# EAGLE design SCK_URBAN_BOARD_2.2 (EAGLE 9.6.2)
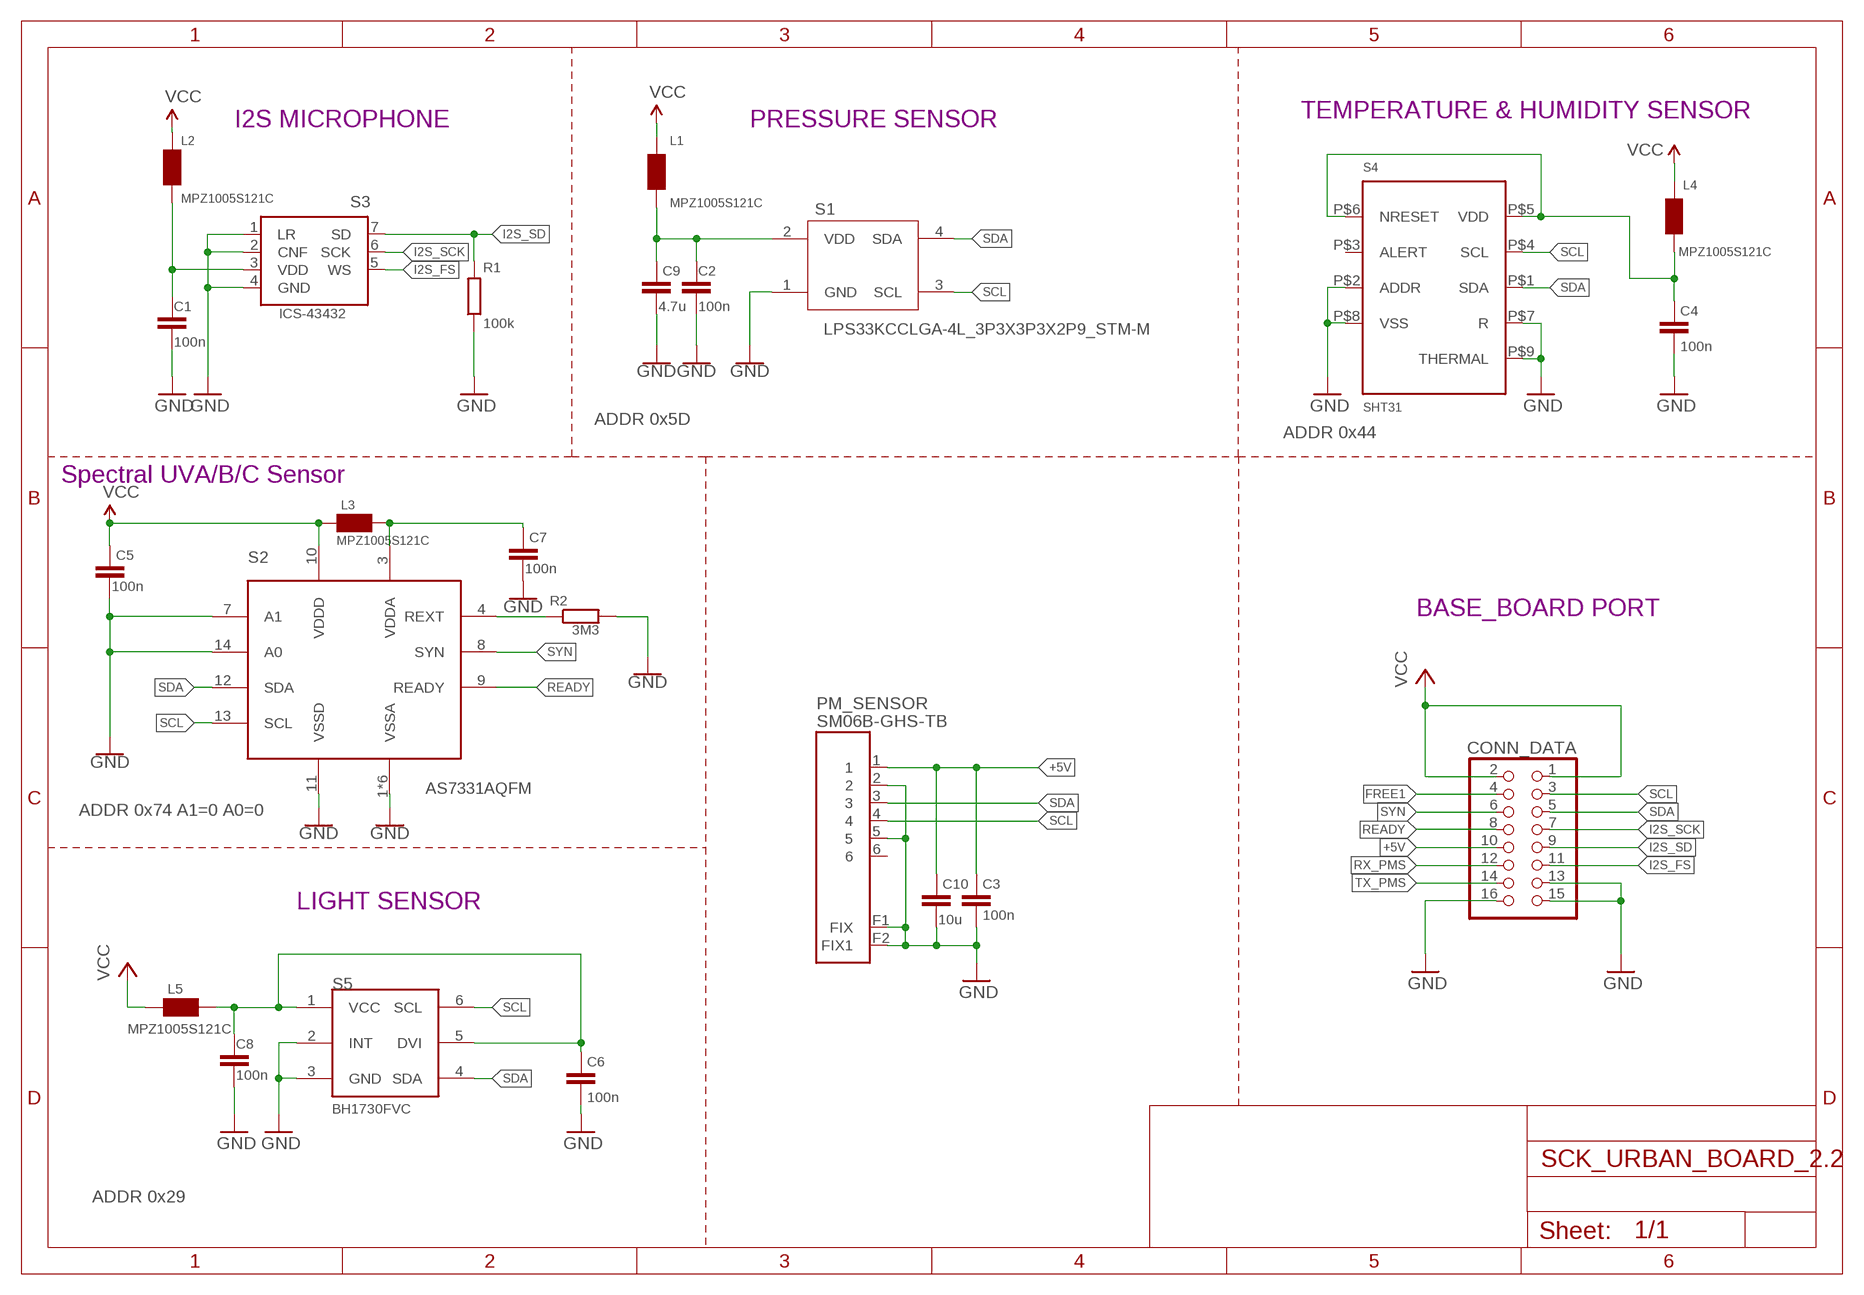
[diagram p0: schematic, sheet 1]

## Parts
C1  100n  C-EUC0402  [C0402]
C2  100n  C-EUC0402  [C0402]
C3  100n  C-EUC0402  [C0402]
C4  100n  C-EUC0402  [C0402]
C5  100n  C-EUC0402  [C0402]
C6  100n  C-EUC0402  [C0402]
C7  100n  C-EUC0402  [C0402]
C8  100n  C-EUC0402  [C0402]
C9  4.7u  C-EUC0603  [C0603]
C10  10u  C-EUC0603  [C0603]
CONN_DATA  PINHD_2X8MAL_SMD  [PINHD_2X8_SMD_MALE_UNHOLED]
L1  MPZ1005S121C  FERRITE-BEAD_0402  [L0402]
L2  MPZ1005S121C  FERRITE-BEAD_0402  [L0402]
L3  MPZ1005S121C  FERRITE-BEAD_0402  [L0402]
L4  MPZ1005S121C  FERRITE-BEAD_0402  [L0402]
L5  MPZ1005S121C  FERRITE-BEAD_0402  [L0402]
PM_SENSOR  SM06B-GHS-TB  [SM06B-GHS-TB]
R1  100k  R-EU_R0402  [R0402]
R2  3M3  R-EU_R0402  [R0402]
S1  LPS33KCCLGA-4L_3P3X3P3X2P9_STM-M  [CCLGA-4L_3P3X3P3X2P9_STM-M]
S2  AS7331AQFM  [OLGA16]
S3  ICS-43432  [ICS-43432]
S4  SHT31  SHT3X-DIS  [DFN8_STH3X-DIS]
S5  BH1730FVC  [WSOF6]

## Nets
+5V: C3.2 C10.2 CONN_DATA.10 PM_SENSOR.1
FREE1: CONN_DATA.4
GND: C1.1 C2.1 C3.1 C4.1 C5.1 C6.1 C7.1 C8.1 C9.1 C10.1 CONN_DATA.13 CONN_DATA.15 CONN_DATA.16 PM_SENSOR.2 PM_SENSOR.5 PM_SENSOR.F1(FIX) PM_SENSOR.F2(FIX1) R1.1 R2.2 S1.1(GND) S2.1(VSSA) S2.2(VSSA) S2.5(VSSA) S2.6(VSSA) S2.7(A1) S2.11(VSSD) S2.14(A0) S2.15(VSSA) S2.16(VSSA) S3.1(LR) S3.2(CNF) S3.4(GND) S4.P$2(ADDR) S4.P$7(R) S4.P$8(VSS) S4.P$9(THERMAL) S5.2(INT) S5.3(GND)
I2S_FS: CONN_DATA.11 S3.5(WS)
I2S_SCK: CONN_DATA.7 S3.6(SCK)
I2S_SD: CONN_DATA.9 R1.2 S3.7(SD)
N$1: C7.2 L3.1 S2.3(VDDA)
N$2: R2.1 S2.4(REXT)
N$3: C6.2 C8.2 L5.2 S5.1(VCC) S5.5(DVI)
N$5: C4.2 L4.2 S4.P$5(VDD) S4.P$6(NRESET)
N$6: C2.2 C9.2 L1.2 S1.2(VDD)
N$17: C1.2 L2.2 S3.3(VDD)
READY: CONN_DATA.8 S2.9(READY)
RX_PMS: CONN_DATA.12
SCL: CONN_DATA.3 PM_SENSOR.4 S1.3(SCL) S2.13(SCL) S4.P$4(SCL) S5.6(SCL)
SDA: CONN_DATA.5 PM_SENSOR.3 S1.4(SDA) S2.12(SDA) S4.P$1(SDA) S5.4(SDA)
SYN: CONN_DATA.6 S2.8(SYN)
TX_PMS: CONN_DATA.14
VCC: C5.2 CONN_DATA.1 CONN_DATA.2 L1.1 L2.1 L3.2 L4.1 L5.1 S2.10(VDDD)
Unconnected: PM_SENSOR.6 S4.P$3(ALERT)

## Notes on the sheet
- TEMPERATURE & HUMIDITY SENSOR
- I2S MICROPHONE | PRESSURE SENSOR
- ADDR 0x5D
- ADDR 0x44
- Spectral UVA/B/C Sensor
- BASE_BOARD PORT
- ADDR 0x74 A1=0 A0=0
- LIGHT SENSOR
- ADDR 0x29

## Library data of the parts
C1-C10 = Hangar3D:C-EU: CAPACITOR, European symbol
CONN_DATA = Hangar3D:PINHD_2X8
L1-L5 = Hangar3D:FERRITE-BEAD: SMD EMI Suppression Ferrite Beads - excellent anti-EMI properties - low DCR - impedances till 3000 ohms - rated current up to 6 A
PM_SENSOR = Hangar3D:SM06B-GHS-TB
R1 R2 = Hangar3D:R-EU_: RESISTOR, European symbol
S1 = Hangar3D:LPS33K; COPYRIGHT: Copyright (C) 2023 Ultra Librarian. All rights reserved.; MANUFACTURER_PART_NUMBER: LPS33K; MFR_NAME: STMicroelectronics
S2 = Hangar3D:AS7331
S3 = Hangar3D:ICS-43432
S4 = Hangar3D:SHT3X-DIS
S5 = Hangar3D:BH1730FVC

## Net classes
1 power: width 1 mm, drill 0.6 mm, clearance 0.203 mm
2 gnd: width 0.254 mm, drill 0.254 mm, clearance 0.178 mm
3 usbvcc: width 0.254 mm, drill 0.6 mm, clearance 0.203 mm
4 aref: width 0.254 mm, drill 0.6 mm, clearance 0.203 mm

## Board
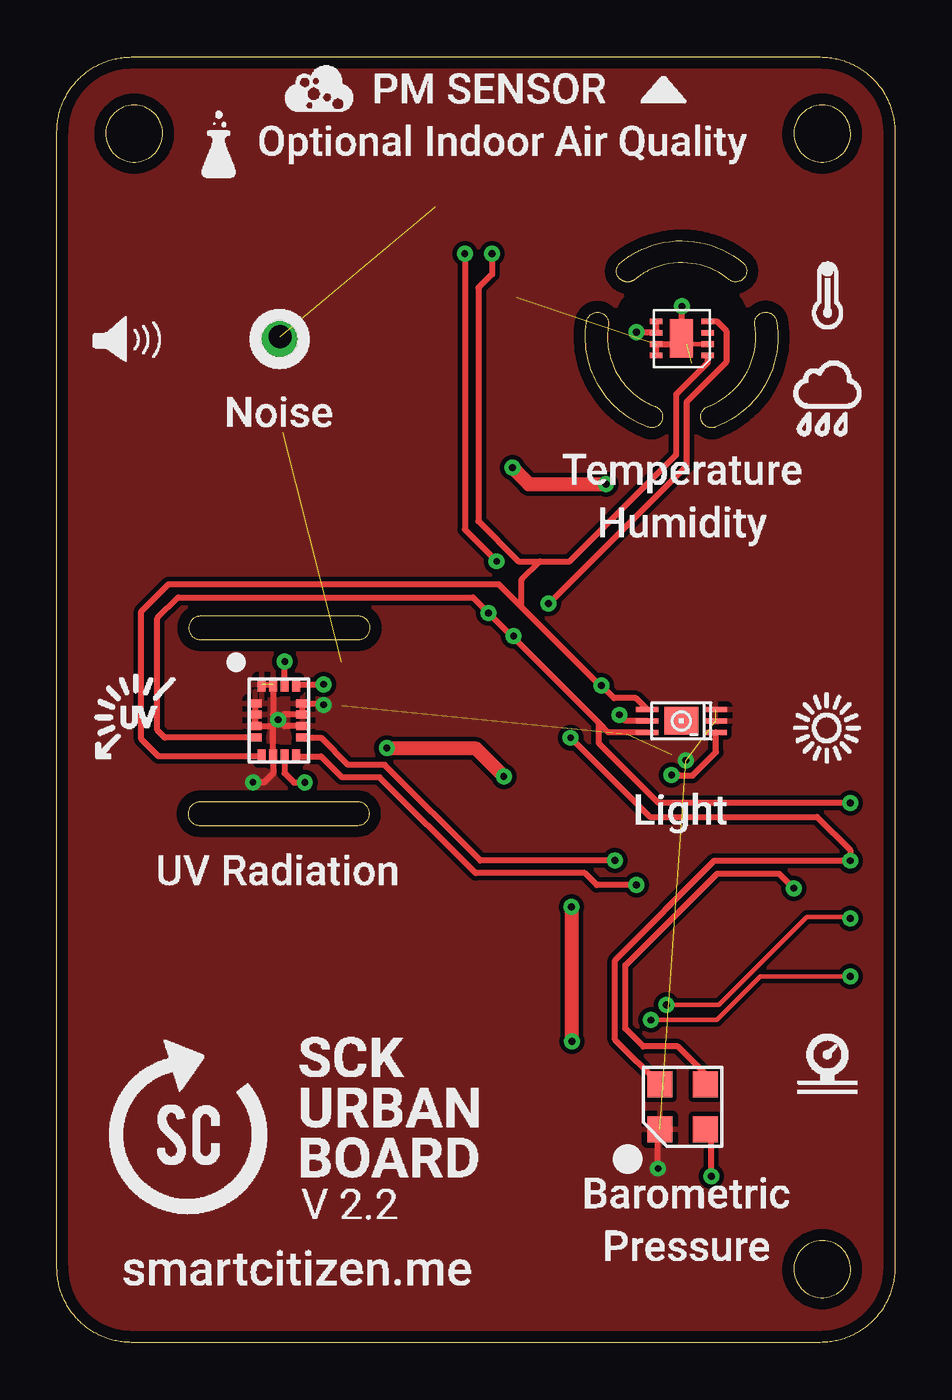
[diagram p1: board, top side]
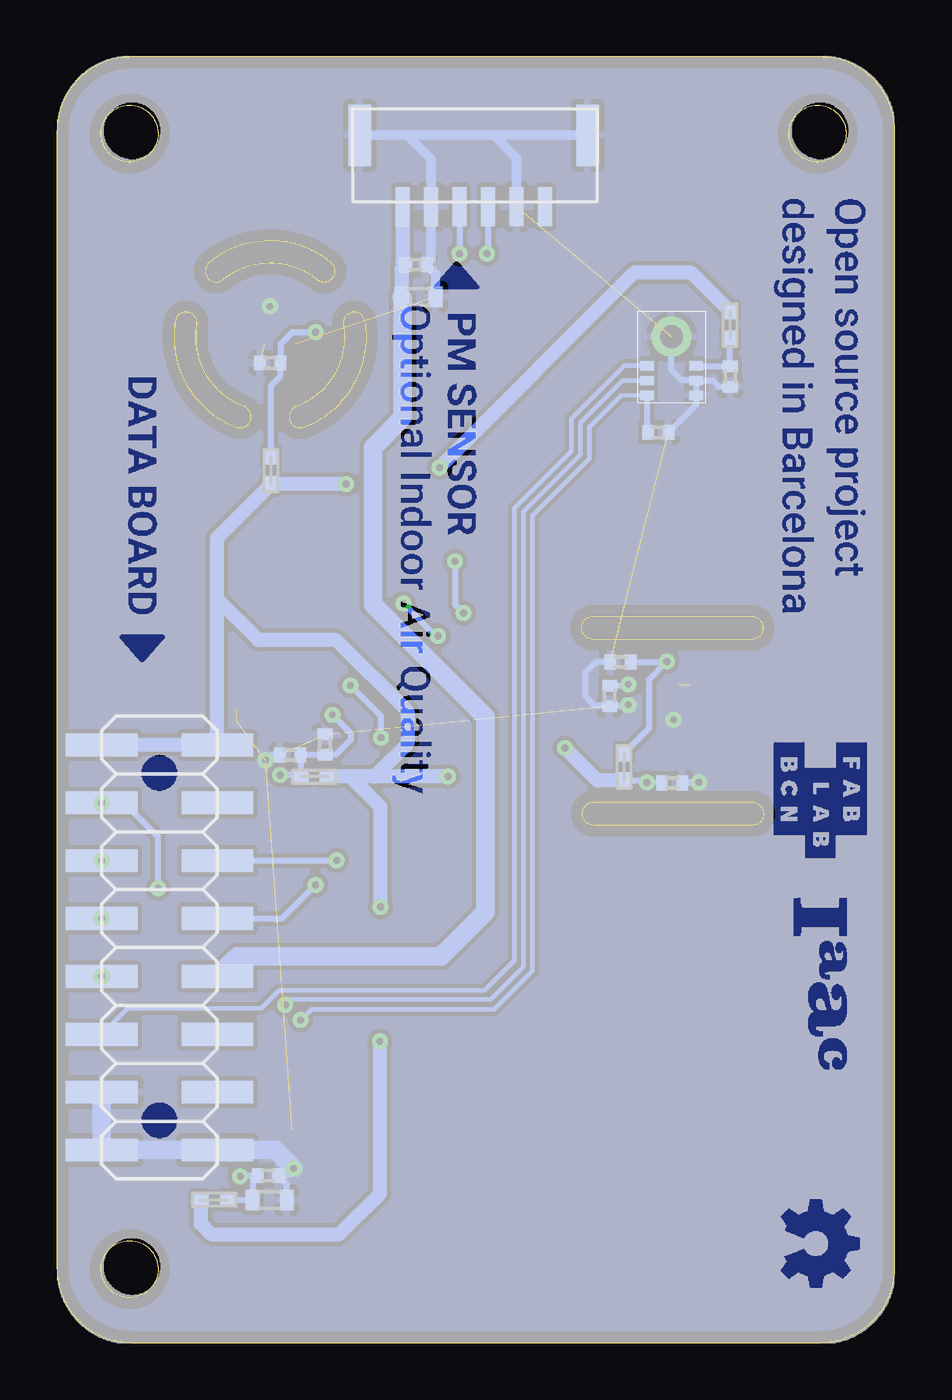
[diagram p2: board, bottom side, seen from below]

Size 36.78 x 56.42 mm. Coordinates in mm from the lower left corner, seen from the top.
Outline: 33.51,0 3.27,0 3.18,0 3.1,0 3.02,0.01 2.94,0.02 2.85,0.03 2.77,0.04 2.69,0.05 2.61,0.07 2.53,0.08 2.45,0.1 2.38,0.12 2.3,0.15 2.22,0.17 2.15,0.2 2.07,0.23 2,0.26 1.93,0.29 1.85,0.32 1.78,0.36 1.71,0.4 1.65,0.43 1.58,0.47 1.51,0.52 1.44,0.56 1.38,0.6 1.32,0.65 1.25,0.7 1.19,0.75 1.13,0.8 1.07,0.85 1.02,0.91 0.96,0.96 0.91,1.02 0.85,1.07 0.8,1.13 0.75,1.19 0.7,1.25 0.65,1.32 0.6,1.38 0.56,1.44 0.52,1.51 0.47,1.58 0.43,1.65 0.4,1.71 0.36,1.78 0.32,1.86 0.29,1.93 0.26,2 0.23,2.07 0.2,2.15 0.17,2.22 0.15,2.3 0.12,2.38 0.1,2.45 0.08,2.53 0.07,2.61 0.05,2.69 0.04,2.77 0.03,2.85 0.02,2.94 0.01,3.02 0,3.1 0,3.19 0,3.27 0,53.15 0,53.23 0,53.32 0.01,53.4 0.02,53.48 0.03,53.57 0.04,53.65 0.05,53.73 0.07,53.81 0.08,53.89 0.1,53.97 0.12,54.04 0.15,54.12 0.17,54.2 0.2,54.27 0.23,54.35 0.26,54.42 0.29,54.49 0.32,54.57 0.36,54.64 0.4,54.71 0.43,54.77 0.47,54.84 0.52,54.91 0.56,54.98 0.6,55.04 0.65,55.1 0.7,55.17 0.75,55.23 0.8,55.29 0.85,55.35 0.91,55.4 0.96,55.46 1.02,55.51 1.07,55.57 1.13,55.62 1.19,55.67 1.25,55.72 1.32,55.77 1.38,55.82 1.44,55.86 1.51,55.9 1.58,55.95 1.65,55.98 1.71,56.02 1.78,56.06 1.85,56.1 1.93,56.13 2,56.16 2.07,56.19 2.15,56.22 2.22,56.25 2.3,56.27 2.38,56.3 2.45,56.32 2.53,56.34 2.61,56.35 2.69,56.37 2.77,56.38 2.85,56.39 2.94,56.4 3.02,56.41 3.1,56.42 3.18,56.42 3.27,56.42 33.51,56.42 33.59,56.42 33.68,56.42 33.76,56.41 33.84,56.4 33.92,56.39 34.01,56.38 34.09,56.37 34.17,56.35 34.25,56.34 34.32,56.32 34.4,56.3 34.48,56.27 34.55,56.25 34.63,56.22 34.7,56.19 34.78,56.16 34.85,56.13 34.92,56.1 34.99,56.06 35.06,56.02 35.13,55.98 35.2,55.95 35.27,55.9 35.33,55.86 35.4,55.82 35.46,55.77 35.52,55.72 35.59,55.67 35.65,55.62 35.7,55.57 35.76,55.51 35.82,55.46 35.87,55.4 35.93,55.35 35.98,55.29 36.03,55.23 36.08,55.17 36.13,55.1 36.17,55.04 36.22,54.98 36.26,54.91 36.3,54.84 36.34,54.77 36.38,54.71 36.42,54.64 36.45,54.57 36.49,54.49 36.52,54.42 36.55,54.35 36.58,54.27 36.61,54.2 36.63,54.12 36.65,54.04 36.67,53.97 36.69,53.89 36.71,53.81 36.73,53.73 36.74,53.65 36.75,53.57 36.76,53.48 36.77,53.4 36.77,53.32 36.78,53.23 36.78,53.15 36.78,3.27 36.78,3.19 36.77,3.1 36.77,3.02 36.76,2.94 36.75,2.85 36.74,2.77 36.73,2.69 36.71,2.61 36.69,2.53 36.67,2.45 36.65,2.38 36.63,2.3 36.61,2.22 36.58,2.15 36.55,2.07 36.52,2 36.49,1.93 36.45,1.86 36.42,1.78 36.38,1.71 36.34,1.65 36.3,1.58 36.26,1.51 36.22,1.44 36.17,1.38 36.13,1.32 36.08,1.25 36.03,1.19 35.98,1.13 35.93,1.07 35.87,1.02 35.82,0.96 35.76,0.91 35.7,0.85 35.65,0.8 35.59,0.75 35.52,0.7 35.46,0.65 35.4,0.6 35.33,0.56 35.27,0.52 35.2,0.47 35.13,0.43 35.06,0.4 34.99,0.36 34.92,0.32 34.85,0.29 34.78,0.26 34.7,0.23 34.63,0.2 34.55,0.17 34.48,0.15 34.4,0.12 34.32,0.1 34.25,0.08 34.17,0.07 34.09,0.05 34.01,0.04 33.92,0.03 33.84,0.02 33.76,0.01 33.68,0 33.59,0 33.51,0
Outline: 28.74,40.14 28.71,40.15 28.67,40.15 28.64,40.16 28.61,40.16 28.57,40.17 28.54,40.19 28.51,40.2 28.48,40.22 28.46,40.23 28.43,40.26 28.41,40.28 28.38,40.3 28.36,40.33 28.34,40.36 28.32,40.39 28.3,40.42 28.29,40.45 28.28,40.49 28.27,40.53 28.26,40.58 28.26,40.62 28.26,40.67 28.26,40.71 28.27,40.75 28.29,40.79 28.3,40.83 28.32,40.87 28.34,40.91 28.37,40.94 28.4,40.97 28.43,41 28.47,41.03 28.51,41.05 28.55,41.07 28.68,41.12 28.87,41.21 29.05,41.31 29.22,41.42 29.39,41.54 29.55,41.66 29.7,41.8 29.84,41.95 29.97,42.1 30.09,42.26 30.2,42.43 30.3,42.61 30.39,42.79 30.47,42.98 30.53,43.18 30.59,43.38 30.63,43.58 30.65,43.74 30.66,43.79 30.66,43.84 30.67,43.9 30.67,43.96 30.67,44.01 30.67,44.06 30.68,44.12 30.68,44.17 30.67,44.23 30.67,44.28 30.67,44.34 30.66,44.39 30.66,44.45 30.65,44.5 30.65,44.56 30.64,44.61 30.63,44.66 30.63,44.71 30.63,44.76 30.63,44.8 30.64,44.84 30.65,44.89 30.66,44.93 30.68,44.97 30.7,45 30.73,45.04 30.76,45.07 30.79,45.1 30.82,45.13 30.86,45.15 30.9,45.17 30.94,45.19 30.98,45.2 31.03,45.21 31.07,45.22 31.12,45.22 31.16,45.22 31.2,45.21 31.24,45.2 31.29,45.19 31.32,45.17 31.36,45.15 31.4,45.12 31.43,45.1 31.46,45.07 31.49,45.03 31.52,45 31.54,44.96 31.56,44.92 31.57,44.88 31.58,44.83 31.59,44.77 31.6,44.7 31.61,44.63 31.62,44.56 31.63,44.49 31.63,44.41 31.64,44.34 31.64,44.27 31.64,44.2 31.64,44.13 31.64,44.06 31.64,43.99 31.64,43.92 31.63,43.85 31.63,43.77 31.62,43.7 31.61,43.63 31.59,43.48 31.54,43.21 31.47,42.95 31.39,42.7 31.29,42.45 31.18,42.21 31.05,41.98 30.91,41.76 30.76,41.55 30.59,41.34 30.41,41.15 30.22,40.97 30.02,40.8 29.81,40.65 29.58,40.5 29.35,40.37 29.11,40.26 28.91,40.18 28.9,40.17 28.89,40.17 28.88,40.16 28.87,40.16 28.86,40.16 28.85,40.16 28.84,40.16 28.83,40.15 28.82,40.15 28.81,40.15 28.8,40.15 28.79,40.15 28.78,40.15 28.77,40.15 28.76,40.15 28.75,40.14 28.74,40.14
Outline: 26.1,40.14 26.05,40.15 26.01,40.15 25.96,40.17 25.93,40.17 25.93,40.18 25.91,40.18 25.87,40.2 25.79,40.23 25.63,40.3 25.48,40.38 25.33,40.46 25.18,40.55 25.03,40.64 24.89,40.75 24.88,40.76 24.87,40.76 24.86,40.77 24.85,40.78 24.72,40.88 24.6,40.99 24.48,41.1 24.36,41.22 24.25,41.33 24.15,41.46 24.05,41.58 23.96,41.71 23.87,41.84 23.78,41.98 23.7,42.12 23.63,42.26 23.56,42.4 23.5,42.55 23.45,42.7 23.39,42.85 23.35,43 23.31,43.15 23.27,43.31 23.25,43.47 23.22,43.63 23.21,43.79 23.2,43.95 23.2,44.11 23.2,44.27 23.2,44.43 23.22,44.59 23.24,44.76 23.25,44.8 23.25,44.81 23.25,44.81 23.25,44.81 23.25,44.82 23.25,44.83 23.27,44.88 23.29,44.94 23.31,44.98 23.34,45.02 23.38,45.07 23.41,45.1 23.46,45.13 23.5,45.16 23.55,45.18 23.6,45.2 23.65,45.21 23.7,45.22 23.76,45.22 23.81,45.21 23.86,45.2 23.91,45.18 23.96,45.16 24.01,45.13 24.05,45.09 24.08,45.06 24.12,45.02 24.15,44.97 24.17,44.93 24.19,44.88 24.2,44.83 24.21,44.77 24.21,44.72 24.2,44.66 24.2,44.66 24.2,44.66 24.2,44.65 24.2,44.62 24.19,44.56 24.17,44.43 24.16,44.31 24.16,44.18 24.16,44.06 24.17,43.93 24.18,43.81 24.19,43.69 24.21,43.57 24.23,43.45 24.26,43.33 24.29,43.21 24.33,43.09 24.37,42.98 24.42,42.86 24.47,42.75 24.52,42.64 24.58,42.53 24.64,42.43 24.71,42.32 24.78,42.22 24.85,42.12 24.93,42.02 25.02,41.93 25.1,41.84 25.19,41.75 25.28,41.67 25.38,41.59 25.43,41.55 25.44,41.54 25.45,41.54 25.45,41.54 25.46,41.53 25.48,41.51 25.59,41.43 25.7,41.36 25.82,41.29 25.93,41.23 26.05,41.17 26.18,41.12 26.24,41.09 26.27,41.08 26.29,41.07 26.34,41.05 26.39,41.02 26.43,40.98 26.47,40.94 26.5,40.9 26.53,40.86 26.55,40.81 26.57,40.76 26.58,40.71 26.58,40.66 26.58,40.61 26.58,40.55 26.57,40.5 26.56,40.47 26.55,40.45 26.53,40.41 26.51,40.37 26.49,40.34 26.46,40.3 26.43,40.28 26.4,40.25 26.37,40.23 26.33,40.2 26.3,40.19 26.26,40.17 26.22,40.16 26.18,40.15 26.14,40.15 26.1,40.14
Outline: 25.04,46.54 25.02,46.54 25,46.54 24.97,46.55 24.95,46.55 24.92,46.56 24.9,46.56 24.88,46.57 24.86,46.58 24.83,46.59 24.81,46.6 24.79,46.61 24.77,46.63 24.75,46.64 24.73,46.66 24.71,46.68 24.69,46.69 24.67,46.71 24.65,46.75 24.63,46.79 24.61,46.82 24.59,46.87 24.58,46.91 24.57,46.95 24.56,46.99 24.56,47.04 24.56,47.08 24.57,47.12 24.58,47.16 24.6,47.2 24.61,47.24 24.64,47.28 24.66,47.32 24.69,47.35 24.72,47.38 24.77,47.42 24.82,47.47 24.88,47.51 24.94,47.55 25,47.59 25.05,47.63 25.11,47.67 25.17,47.71 25.23,47.75 25.29,47.78 25.36,47.82 25.42,47.85 25.48,47.89 25.55,47.92 25.61,47.95 25.68,47.98 25.74,48.01 25.87,48.06 26.12,48.15 26.38,48.23 26.64,48.28 26.91,48.32 27.17,48.35 27.43,48.36 27.69,48.35 27.95,48.32 28.21,48.28 28.47,48.22 28.72,48.15 28.97,48.06 29.21,47.96 29.45,47.84 29.68,47.7 29.9,47.55 30.1,47.4 30.13,47.37 30.16,47.33 30.19,47.3 30.21,47.26 30.23,47.22 30.25,47.18 30.26,47.14 30.27,47.1 30.27,47.05 30.27,47.01 30.27,46.97 30.26,46.93 30.25,46.88 30.24,46.84 30.22,46.8 30.19,46.76 30.17,46.73 30.14,46.69 30.1,46.66 30.07,46.63 30.03,46.61 29.99,46.59 29.95,46.57 29.91,46.56 29.87,46.55 29.83,46.55 29.78,46.54 29.74,46.55 29.7,46.55 29.65,46.56 29.61,46.58 29.57,46.59 29.53,46.62 29.5,46.64 29.37,46.74 29.2,46.86 29.03,46.97 28.84,47.06 28.66,47.15 28.47,47.22 28.27,47.28 28.08,47.32 27.88,47.36 27.68,47.38 27.47,47.39 27.27,47.39 27.07,47.37 26.87,47.34 26.66,47.3 26.46,47.25 26.27,47.18 26.14,47.13 26.09,47.1 26.04,47.08 25.99,47.06 25.94,47.03 25.89,47.01 25.84,46.98 25.79,46.95 25.74,46.93 25.7,46.9 25.65,46.87 25.61,46.84 25.56,46.81 25.52,46.78 25.47,46.74 25.43,46.71 25.38,46.68 25.35,46.65 25.33,46.64 25.32,46.62 25.3,46.61 25.28,46.6 25.27,46.59 25.25,46.59 25.23,46.58 25.21,46.57 25.19,46.57 25.18,46.56 25.16,46.55 25.14,46.55 25.12,46.55 25.1,46.55 25.08,46.54 25.06,46.54 25.04,46.54
Outline: 3.39,54.3 3.26,54.3 3.14,54.28 3.02,54.25 2.91,54.21 2.8,54.16 2.7,54.1 2.6,54.03 2.52,53.95 2.44,53.86 2.36,53.77 2.3,53.67 2.25,53.56 2.2,53.45 2.17,53.33 2.15,53.21 2.14,53.09 2.14,52.96 2.16,52.84 2.19,52.72 2.22,52.6 2.27,52.49 2.33,52.39 2.4,52.29 2.48,52.2 2.56,52.12 2.65,52.05 2.75,51.98 2.86,51.93 2.97,51.88 3.08,51.84 3.2,51.82 3.33,51.81 3.45,51.81 3.58,51.82 3.7,51.84 3.81,51.88 3.92,51.93 4.03,51.98 4.13,52.05 4.22,52.12 4.3,52.2 4.38,52.29 4.45,52.39 4.51,52.49 4.56,52.6 4.59,52.72 4.62,52.84 4.64,52.96 4.64,53.09 4.63,53.21 4.61,53.33 4.58,53.45 4.53,53.56 4.48,53.67 4.42,53.77 4.34,53.86 4.26,53.95 4.17,54.03 4.08,54.1 3.98,54.16 3.87,54.21 3.76,54.25 3.64,54.28 3.52,54.3 3.39,54.3
Outline: 33.59,54.3 33.47,54.3 33.34,54.28 33.23,54.25 33.11,54.21 33,54.16 32.9,54.1 32.81,54.03 32.72,53.95 32.64,53.86 32.57,53.77 32.5,53.67 32.45,53.56 32.41,53.45 32.37,53.33 32.35,53.21 32.34,53.09 32.34,52.96 32.36,52.84 32.39,52.72 32.43,52.6 32.47,52.49 32.53,52.39 32.6,52.29 32.68,52.2 32.76,52.12 32.85,52.05 32.95,51.98 33.06,51.93 33.17,51.88 33.28,51.84 33.4,51.82 33.53,51.81 33.65,51.81 33.78,51.82 33.9,51.84 34.01,51.88 34.12,51.93 34.23,51.98 34.33,52.05 34.42,52.12 34.51,52.2 34.58,52.29 34.65,52.39 34.71,52.49 34.76,52.6 34.8,52.72 34.82,52.84 34.84,52.96 34.84,53.09 34.83,53.21 34.81,53.33 34.78,53.45 34.73,53.56 34.68,53.67 34.62,53.77 34.55,53.86 34.46,53.95 34.38,54.03 34.28,54.1 34.18,54.16 34.07,54.21 33.96,54.25 33.84,54.28 33.72,54.3 33.59,54.3
Outline: 33.59,4.47 33.47,4.46 33.34,4.45 33.23,4.42 33.11,4.38 33,4.32 32.9,4.26 32.81,4.19 32.72,4.11 32.64,4.03 32.57,3.93 32.5,3.83 32.45,3.73 32.41,3.62 32.37,3.5 32.35,3.38 32.34,3.25 32.34,3.13 32.36,3 32.39,2.88 32.43,2.77 32.47,2.66 32.53,2.56 32.6,2.46 32.68,2.37 32.76,2.29 32.85,2.21 32.95,2.15 33.06,2.09 33.17,2.04 33.28,2.01 33.4,1.98 33.53,1.97 33.65,1.97 33.78,1.98 33.9,2.01 34.01,2.04 34.12,2.09 34.23,2.15 34.33,2.21 34.42,2.29 34.51,2.37 34.58,2.46 34.65,2.56 34.71,2.66 34.76,2.77 34.8,2.88 34.82,3 34.84,3.13 34.84,3.25 34.83,3.38 34.81,3.5 34.78,3.62 34.73,3.73 34.68,3.83 34.62,3.93 34.55,4.03 34.46,4.11 34.38,4.19 34.28,4.26 34.18,4.32 34.07,4.38 33.96,4.42 33.84,4.45 33.72,4.46 33.59,4.47
Outline: 6.29,31.88 arc90 5.79,31.37 5.79,31.34 arc90 6.27,30.86 13.21,30.86 arc90 13.75,31.34 arc90 13.27,31.88 6.29,31.88
Outline: 6.27,23.72 arc90 5.76,23.21 5.76,23.18 arc90 6.24,22.7 13.18,22.7 arc90 13.72,23.18 arc90 13.24,23.72 6.27,23.72
Copper layers (1*16): Top 0.035mm / dielectric 1.5mm / Bottom 0.035mm
Design rules "default *": minimum track width 0.2mm, minimum drill 0.3mm, track to track 0.2mm, track to pad 0.2mm, pad to pad 0.2mm, via to via 0.2mm, smd to smd 0.2mm, copper to edge 20mil, drill to drill 0.6mm, minimum pad ring 10mil, minimum via ring 0.2mm, stop-mask expansion 2mil, vias tented up to drill 24mil, thermal gap 10mil
tRestrict: area 24.4,41.2 to 30.4,47.2

### Footprints (pad centres in the part's own frame; a part is rotated, then mirrored left to right if it is on the bottom)
C0402 = smd 0.5 x 0.65: 1 -0.45,0; 2 0.45,0
C0603 = smd 0.6 x 0.9: 1 -0.8,0; 2 0.7,0
PINHD_2X8_SMD_MALE_UNHOLED = smd 1 x 3.15: 1 -8.89,-2.54; 2 -8.89,2.54; 3 -6.35,-2.54; 4 -6.35,2.54; 5 -3.81,-2.54; 6 -3.81,2.54; 7 -1.27,-2.54; 8 -1.27,2.54; 9 1.27,-2.54; 10 1.27,2.54; 11 3.81,-2.54; 12 3.81,2.54; 13 6.35,-2.54; 14 6.35,2.54; 15 8.89,-2.54; 16 8.89,2.54
L0402 = smd 0.7 x 0.6: 1 -0.6,0; 2 0.6,0
SM06B-GHS-TB = smd 0.6 x 1.7: 1 -3.125,0; 2 -1.875,0; 3 -0.625,0; 4 0.625,0; 5 1.875,0; 6 3.125,0 | smd 1 x 2.7: F1 -5,3.125; F2 5,3.125
R0402 = smd 0.5 x 0.65: 1 -0.45,0; 2 0.45,0
CCLGA-4L_3P3X3P3X2P9_STM-M = smd 1.141 x 1.091: 1 -0.978,1; 2 -0.978,-1; 3 0.978,-1; 4 0.978,1
OLGA16 = smd 0.35 x 0.6: 1 -0.75,1.575; 2 -0.25,1.575; 3 0.25,1.575; 4 0.75,1.575; 9 0.75,-1.575; 10 0.25,-1.575; 11 -0.25,-1.575; 12 -0.75,-1.575 | smd 0.6 x 0.35: 5 1.05,0.75; 6 1.05,0.25; 7 1.05,-0.25; 8 1.05,-0.75; 13 -1.05,-0.75; 14 -1.05,-0.25; 15 -1.05,0.25; 16 -1.05,0.75
ICS-43432 = smd 0.4 x 0.6: 1 2.572,1.079; 2 1.924,1.079; 3 1.276,1.079; 5 1.276,-1.079; 6 1.924,-1.079; 7 2.572,-1.079 | drill 1 pad 1.75: 4 0,0
DFN8_STH3X-DIS = smd 0.55 x 0.25: P$1 -1.149,0.737; P$2 -1.149,0.237; P$3 -1.149,-0.263; P$4 -1.149,-0.763; P$5 1.101,-0.763; P$6 1.101,-0.263; P$7 1.101,0.237; P$8 1.101,0.737 | smd 1 x 1.7: P$9 0.001,-0.013
WSOF6 = smd 0.22 x 1: 1 -0.5,-1.5; 2 0,-1.5; 3 0.5,-1.5; 4 0.5,1.5; 5 0,1.5; 6 -0.5,1.5 | smd 1.2 x 1.5: P$1 0,0

### Placement (x,y rotation side)
C1  7.22,42.4 90 bottom
C2  27.52,7.32 180 bottom
C3  21.02,47.31 180 bottom
C4  27.41,42.99 0 bottom
C5  9.77,24.56 180 bottom
C6  25.02,26.24 270 bottom
C7  12.04,29.87 0 bottom
C8  26.55,25.79 0 bottom
C9  27.49,6.25 180 bottom
C10  20.96,45.89 180 bottom
CONN_DATA  32.28,17.34 270 bottom
L1  29.87,6.26 0 bottom
L2  7.24,44.65 270 bottom
L3  11.89,25.26 270 bottom
L4  27.37,38.27 90 bottom
L5  25.49,24.83 180 bottom
PM_SENSOR  18.49,49.85 0 bottom
R1  10.38,39.94 180 bottom
R2  12.52,28.38 270 bottom
S1  27.46,10.34 90 top
S2  9.74,27.3 0 top
S3  9.8,44.14 270 bottom
S4  27.41,44.05 180 top
S5  27.41,27.28 90 top

### Tracks (layer width: path | path; a pad name or v marks a point on that pad's centre or on a via)
+5V
  Bottom 0.61: PM_SENSOR.1 21.61,47.45 C3.2 21.66,47.12 C10.2
  Bottom 0.813: CONN_DATA.10 28.86,16.94 19.93,16.94 17.98,18.89 17.98,27.46 22.9,32.39 22.9,39.29 21.6,40.59 21.6,45.83 C10.2
GND  (via drill 0.3, 0.3 pad 0.7)  (10 unrouted)
  Top 0.2: S4.P$2 27.66,43.82 S4.P$9
  Top 0.254: S4.P$9 27.41,43.93 27.3,43.82 S4.P$7 S4.P$8 | S4.P$9 27.66,43.82 | v27.43,45.48 27.41,45.45 S4.P$9 | v26.39,7.63 26.39,9.29 S1.1 | 9.82,27.33 v9.71,27.33 | S2.7 9.99,27.05 v9.71,27.33 | v9.71,27.33 9.93,27.55 S2.6 S2.5 11.64,28.05 v11.7,27.99 | S2.16 S2.15 | S2.15 S2.14 9.44,27.05 v9.71,27.33 | v9.71,27.33 9.49,27.11 S2.11 9.49,24.97 9.1,24.59 v8.6,24.59 | S2.1 S2.2 9.49,27.56 v9.71,27.33 | S2.14 S2.15 | S4.P$2
  Bottom 0.254: v26.39,7.63 26.7,7.32 C2.1 26.69,6.95 C9.1 | S3.2 8,42.22 7.72,41.95 C1.1 | S3.2 S3.1 8.72,41.16 R1.1 | S3.2 8.74,42.24 9.36,42.24 9.8,42.68 S3.4 | C8.1 27.38,25.79 v27.61,25.55 | v8.6,24.59 9.29,24.59 C5.1 | C7.1 13.12,29.87 13.6,29.39 13.6,28.39 13.2,27.99 12.58,27.99 R2.2 12.46,27.99 v11.7,27.99
  Bottom 0.406: PM_SENSOR.F2 17.6,52.98 | 17.6,52.98 21.4,52.98 | 21.4,52.98 PM_SENSOR.F1 | 21.4,52.98 20.36,51.94 PM_SENSOR.2 20.36,47.52 C3.1 20.16,46.9 C10.1 | PM_SENSOR.5 16.61,51.99 17.6,52.98
  Bottom 0.813: CONN_DATA.13 CONN_DATA.15 CONN_DATA.16 27.2,8.45 v26.39,7.63
  pour Bottom (rank 2): 37.28,57.44 -0.72,57.79 -0.45,-0.89 37.33,-1.06
  pour Top (rank 2): 37.28,57.44 -0.72,57.54 -0.82,-0.91 37.28,-0.86
I2S_FS
  Bottom 0.2: S3.5 11.87,42.87 14.2,40.54 14.2,39.13 16.7,36.63 16.7,16.78 18.01,15.46 27.02,15.46 27.83,14.66 33.68,14.66 CONN_DATA.11
I2S_SCK  (via drill 0.3 pad 0.7)
  Top 0.2: v26.76,14.81 29.05,14.81 32.91,18.67 34.76,18.67 CONN_DATA.7
  Bottom 0.2: S3.6 11.95,42.22 13.76,40.41 13.8,40.37 13.8,38.96 16.3,36.46 16.3,16.48 17.72,15.06 26.5,15.06 v26.74,14.81 v26.76,14.81
  other vias: 34.82,18.61
I2S_SD  (via drill 0.3 pad 0.7)
  Top 0.2: CONN_DATA.9 30.87,16.07 28.96,14.16 26.09,14.16 v26.08,14.15
  Bottom 0.2: S3.7 12.01,41.57 13.4,40.18 13.4,38.8 15.9,36.3 15.9,16.32 17.59,14.63 25.6,14.63 v26.08,14.15
  Bottom 0.254: S3.7 10.88,39.99 R1.2
  other vias: 34.82,16.07
N$1  (via drill 0.3)
  Top 0.254: S2.3 9.99,29.87 v10,29.89
  Bottom 0.254: C7.2 10.02,29.87 v10,29.89 10.8,29.09 10.8,26.94 L3.1
N$2  (via drill 0.3)
  Top 0.254: S2.4 v11.7,28.89
  Bottom 0.254: R2.1 11.76,28.83 v11.7,28.89
N$3  (via drill 0.3 pad 0.7)
  Top 0.254: S5.5 24.95,27.28 v24.69,27.55 | S5.1 28.93,26.77 28.93,25.91 27.89,24.88 27.33,24.88 27.29,24.91 v26.98,24.91
  Bottom 0.254: v24.69,27.55 23.89,26.75 23.89,26.44 24.54,25.79 C6.2 C8.2 L5.2 26.17,24.91 v26.98,24.91
N$5  (via drill 0.3 pad 0.7)
  Top 0.254: S4.P$5 S4.P$6 25.46,44.32 v25.43,44.35
  Bottom 0.254: v25.43,44.35 26.44,44.35 26.96,43.83 C4.2 26.96,42.42 27.37,42.01 L4.2
N$6  (via drill 0.3 pad 0.7)
  Top 0.254: v28.73,7.3 28.73,9.1 S1.2
  Bottom 0.254: v28.73,7.3 28.7,7.32 C2.2 28.19,7.1 C9.2 L1.2
N$17
  Bottom 0.254: S3.3 8.7,42.85 C1.2 7.23,42.87 L2.2
READY  (via drill 0.3 pad 0.7)
  Top 0.254: v25.43,20.08 23.7,20.08 23.17,20.61 18.37,20.61 14.17,24.81 12.51,24.81 11.59,25.73 S2.9
  Bottom 0.254: CONN_DATA.8 26.9,18.61 v25.43,20.08
SCL  (via drill 0.3, 0.3 pad 0.7)
  Top 0.254: v21.57,32.43 21.6,32.43 27.63,38.46 27.63,41.27 29.38,43.02 29.38,44.4 28.97,44.82 S4.P$4 | S5.6 24.2,26.78 23.8,27.18 | 23.8,27.18 19.97,31.01 v20.05,31.01 19.95,31.01 v18.94,32.02 18.25,32.71 5.32,32.71 4.4,31.79 4.4,26.89 4.74,26.55 S2.13 | CONN_DATA.3 26.39,23.69 23.8,26.28 23.8,27.18 | S1.3 28.46,11.8 27.26,13 25.74,13 24.95,13.78 24.95,16.55 28.99,20.59 31.69,20.59 v32.34,19.94 | v17.9,47.79 17.9,35.69 v19.3,34.29
  Bottom 0.254: v21.57,32.43 20.16,31.01 v20.05,31.01 | v32.34,19.94 32.34,22.2 33.83,23.69 CONN_DATA.3 | v17.9,47.79 17.86,47.83 PM_SENSOR.4 | v19.3,34.29 19.3,32.39 v18.94,32.02
  other vias: 34.82,23.69
SDA  (via drill 0.3, 0.3 pad 0.7)
  Top 0.254: S4.P$1 28.56,42.99 27.18,41.61 27.18,38.96 22.5,34.28 21.2,34.28 | v22.55,26.54 26.02,23.07 33.36,23.07 34.82,21.61 CONN_DATA.5 28.87,21.15 24.5,16.78 24.5,13.28 S1.4 | S5.4 25.41,28.28 24.45,28.28 v23.9,28.84 23.83,28.84 20.39,32.28 | S2.12 4.46,25.73 3.7,26.49 3.7,32.09 4.9,33.29 19.38,33.29 20.39,32.28 | v19.1,47.79 19.1,46.89 18.5,46.29 18.5,36.04 20.26,34.28 21.2,34.28 | 20.39,32.28 20.39,33.48 21.2,34.28
  Bottom 0.254: v22.55,26.54 22.55,27.49 v23.9,28.84 | PM_SENSOR.3 v19.11,47.8 v19.1,47.79
  other vias: 34.82,21.15
SYN  (via drill 0.3 pad 0.7)
  Top 0.254: v24.5,21.15 18.58,21.15 14.38,25.35 12.79,25.35 11.59,26.55 S2.8
  Bottom 0.254: CONN_DATA.6 v24.5,21.15
VCC  (via drill 0.3, 0.3 pad 0.7)
  Top 0.254: S2.10 9.99,24.99 10.4,24.58 v10.88,24.58
  Top 0.61: v22.58,19.12 22.58,13.25 v22.61,13.22 | v19.61,24.85 18.4,26.06 14.51,26.06 v14.48,26.09 | v19.99,38.4 20.72,37.67 v24.09,37.67
  Bottom 0.254: C5.2 10.24,24.58 v10.88,24.58 10.96,24.66 L3.2
  Bottom 0.61: 22.83,24.83 23.9,24.83 | 23.9,24.83 L5.1 | 29.74,32.64 CONN_DATA.2 CONN_DATA.1 | 29.74,32.64 29.74,35.31 L4.1 24.19,37.67 v24.09,37.67 | L2.1 8.93,46.94 11.45,46.94 v19.99,38.4 | 22.83,24.83 21.39,26.27 21.39,27.71 24.52,30.83 27.93,30.83 29.74,32.64 | L1.1 30.47,5.23 30,4.76 24.38,4.76 22.61,6.53 v22.61,13.22 | 23.9,24.83 22.58,23.51 v22.58,19.12 | v19.61,24.85 19.63,24.83 22.83,24.83 | L3.2 13.05,24.66 v14.48,26.09

### Text on the board
_tNames: S1
_bNames: S3